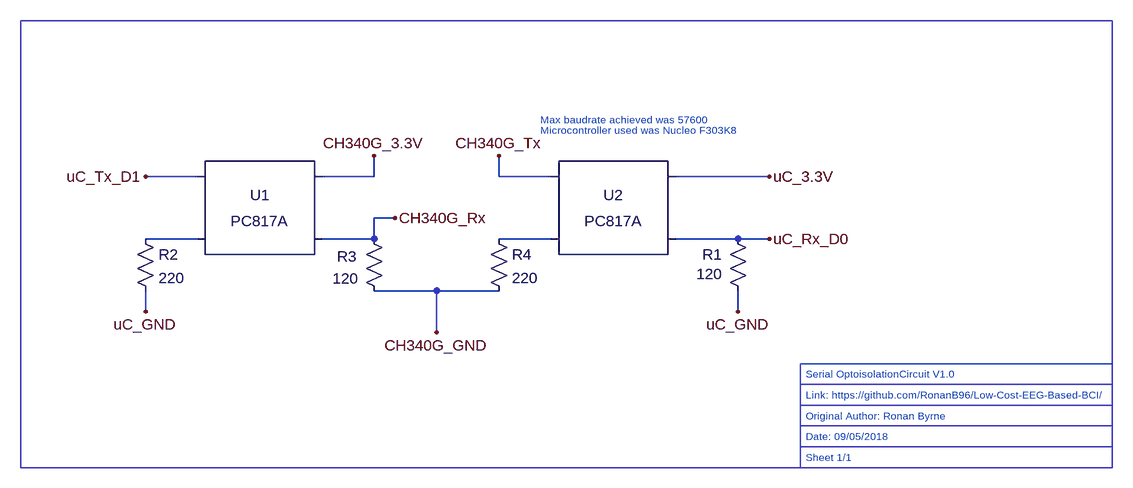
[diagram p0: schematic opto_iso_sch.asc]
opto_iso_sch.asc, the LTspice schematic file:
Version 4
SHEET 1 1344 680
WIRE -112 96 -192 96
WIRE 160 96 160 64
WIRE 160 96 80 96
WIRE 352 96 352 64
WIRE 432 96 352 96
WIRE 768 96 624 96
WIRE 192 160 160 160
WIRE -112 192 -192 192
WIRE 160 192 160 160
WIRE 160 192 80 192
WIRE 432 192 352 192
WIRE 720 192 624 192
WIRE 768 192 720 192
WIRE 256 272 160 272
WIRE 352 272 256 272
WIRE -192 304 -192 272
WIRE 720 304 720 272
WIRE 256 336 256 272
FLAG -192 96 uC_Tx_D1
FLAG -192 304 uC_GND
FLAG 720 304 uC_GND
FLAG 256 336 CH340G_GND
FLAG 160 64 CH340G_3.3V
FLAG 352 64 CH340G_Tx
FLAG 768 192 uC_Rx_D0
FLAG 768 96 uC_3.3V
FLAG 192 160 CH340G_Rx
SYMBOL res 704 176 R0
WINDOW 0 -39 40 Left 2
WINDOW 3 -48 70 Left 2
SYMATTR InstName R1
SYMATTR Value 120
SYMBOL res -208 176 R0
SYMATTR InstName R2
SYMATTR Value 220
SYMBOL res 144 176 R0
WINDOW 0 -41 43 Left 2
WINDOW 3 -48 77 Left 2
SYMATTR InstName R3
SYMATTR Value 120
SYMBOL res 336 176 R0
SYMATTR InstName R4
SYMATTR Value 220
SYMBOL Optos\\PC817A -16 144 R0
SYMATTR InstName U1
SYMBOL Optos\\PC817A 528 144 R0
SYMATTR InstName U2
TEXT 824 464 Left 1 ;Original Author: Ronan Byrne
TEXT 824 432 Left 1 ;Link: https://github.com/RonanB96/Low-Cost-EEG-Based-BCI/
TEXT 824 496 Left 1 ;Date: 09/05/2018
TEXT 824 528 Left 1 ;Sheet 1/1
TEXT 824 400 Left 1 ;Serial OptoisolationCircuit V1.0
TEXT 416 8 Left 1 ;Max baudrate achieved was 57600
TEXT 416 24 Left 1 ;Microcontroller used was Nucleo F303K8
LINE Normal 1296 496 1296 512 2
LINE Normal 816 416 816 544
LINE Normal 1296 416 832 416
LINE Normal 1296 448 1296 416 2
LINE Normal 832 448 1296 448
LINE Normal 1296 480 832 480
LINE Normal 1296 512 1296 480 2
LINE Normal 832 512 1296 512
LINE Normal 1296 384 832 384
LINE Normal 816 384 816 512
LINE Normal 832 384 816 384
LINE Normal 832 416 816 416
LINE Normal 832 448 816 448
LINE Normal 832 480 816 480
LINE Normal 832 512 816 512
RECTANGLE Normal 1296 544 -384 -144

The netlist it stands for:
* opto_iso_sch.asc
R1 uC_Rx_D0 uC_GND 120
R2 N001 uC_GND 220
R3 CH340G_Rx CH340G_GND 120
R4 N002 CH340G_GND 220
XU1 uC_Tx_D1 N001 CH340G_3.3V CH340G_Rx PC817 Igain=1m
XU2 CH340G_Tx N002 uC_3.3V uC_Rx_D0 PC817 Igain=1m
* Original Author: Ronan Byrne
* Link: https://github.com/RonanB96/Low-Cost-EEG-Based-BCI/
* Date: 09/05/2018
* Sheet 1/1
* Serial OptoisolationCircuit V1.0
* Max baudrate achieved was 57600
* Microcontroller used was Nucleo F303K8
.lib PC817.sub
.backanno
.end